# EAGLE design SpectroSlave (EAGLE 7.3.0)
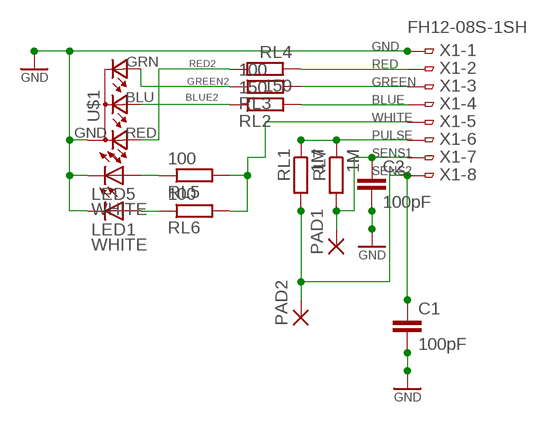
[diagram p0: schematic, sheet 1]

## Parts
C1  100pF  C-EUC0805  [C0805]
C2  100pF  C-EUC0805  [C0805]
LED1  WHITE  LED3MM  [LED3MM]
LED5  WHITE  LED3MM  [LED3MM]
PAD1  SMD5  [SMD2,54-5,08]
PAD2  SMD5  [SMD2,54-5,08]
RL1  1M  R-EU_R0805  [R0805]
RL2  150  R-EU_R0805  [R0805]
RL3  100  R-EU_R0805  [R0805]
RL4  150  R-EU_R0805  [R0805]
RL5  100  R-EU_R0805  [R0805]
RL6  100  R-EU_R0805  [R0805]
RL7  1M  R-EU_R0805  [R0805]
U$1  RGB-COMMON-CATHODE  [LED-TRICOLOR-THROUGHHOLE]
X1  FH12-08S-1SH  [FH12-08S-1SH]

## Nets
BLUE: RL2.2 X1.4
BLUE2: RL2.1 U$1.BLU(CBLUE)
GND [power]: C1.2 C2.2 LED1.K(C) LED5.K(C) U$1.GND(A2) X1.1
GREEN: RL3.2 X1.3
GREEN2: RL3.1 U$1.GRN(CGREEN)
N$4: LED5.A RL5.1
N$5: LED1.A RL6.1
PULSE: RL1.1 RL7.1 X1.6
RED: RL4.1 X1.2
RED2: RL4.2 U$1.RED(CRED)
SENS1: C2.1 PAD1.1(P) RL7.2 X1.7
SENS2: C1.1 PAD2.1(P) RL1.2 X1.8
WHITE: RL5.2 RL6.2 X1.5

## Library data of the parts
C1 C2 = rcl:C-EU: CAPACITOR, European symbol
LED1 LED5 = led:LED: LED OSRAM: - CHIPLED LG R971, LG N971, LY N971, LG Q971, LY Q971, LO R971, LY R971 LH N974, LH R974 LS Q976, LO Q976, LY Q976 LO Q996 - Hyper CHIPLED LW Q18S LB Q993, LB Q99A, LB R99A - SideLED LS A670, LO A670, LY A670, LG A670, LP A670 LB A673, LV A673, LT A673, LW A673 LH A674 LY A675 LS A676, LA A676, LO A676, LY A676, LW A676 LS A679, LY A679, LG A679 - Hyper Micro SIDELED® LS Y876, LA Y876, LO Y876, LY Y876 LT Y87S - SmartLED LW L88C, LW L88S LB L89C, LB L89S, LG L890 LS L89K, LO L89K, LY L89K LS L896, LA L896, LO L896, LY L896 - TOPLED LS T670, LO T670, LY T670, LG T670, LP T670 LSG T670, LSP T670, LSY T670, LOP T670, LYG T670 LG T671, LOG T671, LSG T671 LB T673, LV T673, LT T673, LW T673 LH T674 LS T676, LA T676, LO T676, LY T676, LB T676, LH T676, LSB T676, LW T676 LB T67C, LV T67C, LT T67C, LS T67K, LO T67K, LY T67K, LW E67C LS E67B, LA E67B, LO E67B, LY E67B, LB E67C, LV E67C, LT E67C LW T67C LS T679, LY T679, LG T679 LS T770, LO T770, LY T770, LG T770, LP T770 LB T773, LV T773, LT T773, LW T773 LH T774 LS E675, LA E675, LY E675, LS T675 LS T776, LA T776, LO T776, LY T776, LB T776 LHGB T686 LT T68C, LB T68C - Hyper Mini TOPLED® LB M676 - Mini TOPLED Santana® LG M470 LS M47K, LO M47K, LY M47K Source: http://www.osram.convergy.de LUXEON: - LUMILED® LXK2-PW12-R00, LXK2-PW12-S00, LXK2-PW14-U00, LXK2-PW14-V00 LXK2-PM12-R00, LXK2-PM12-S00, LXK2-PM14-U00 LXK2-PE12-Q00, LXK2-PE12-R00, LXK2-PE12-S00, LXK2-PE14-T00, LXK2-PE14-U00 LXK2-PB12-K00, LXK2-PB12-L00, LXK2-PB12-M00, LXK2-PB14-N00, LXK2-PB14-P00, LXK2-PB14-Q00 LXK2-PR12-L00, LXK2-PR12-M00, LXK2-PR14-Q00, LXK2-PR14-R00 LXK2-PD12-Q00, LXK2-PD12-R00, LXK2-PD12-S00 LXK2-PH12-R00, LXK2-PH12-S00 LXK2-PL12-P00, LXK2-PL12-Q00, LXK2-PL12-R00 Source: www.luxeon.com KINGBRIGHT: KA-3528ASYC Source: www.kingbright.com
PAD1 PAD2 = wirepad:SMD5: SMD PAD
RL1-RL7 = rcl:R-EU_: RESISTOR, European symbol
U$1 = lpatiny:RGB-COMMON-CATHODE
X1 = con-hirose:FH12-08S-1S: 1mm Pitch Connectors For FPC/FFC Source: Data sheet <http://www.hirose.co.jp/cataloge_hp/e58605370.pdf>; OC_FARNELL: unknown; OC_NEWARK: unknown

## Net classes
0 default: width 0.457 mm
1 power: width 0.457 mm
2 VIN: width 0.457 mm
3 fine: width 0.457 mm
4 aref: width 0.457 mm

## Board
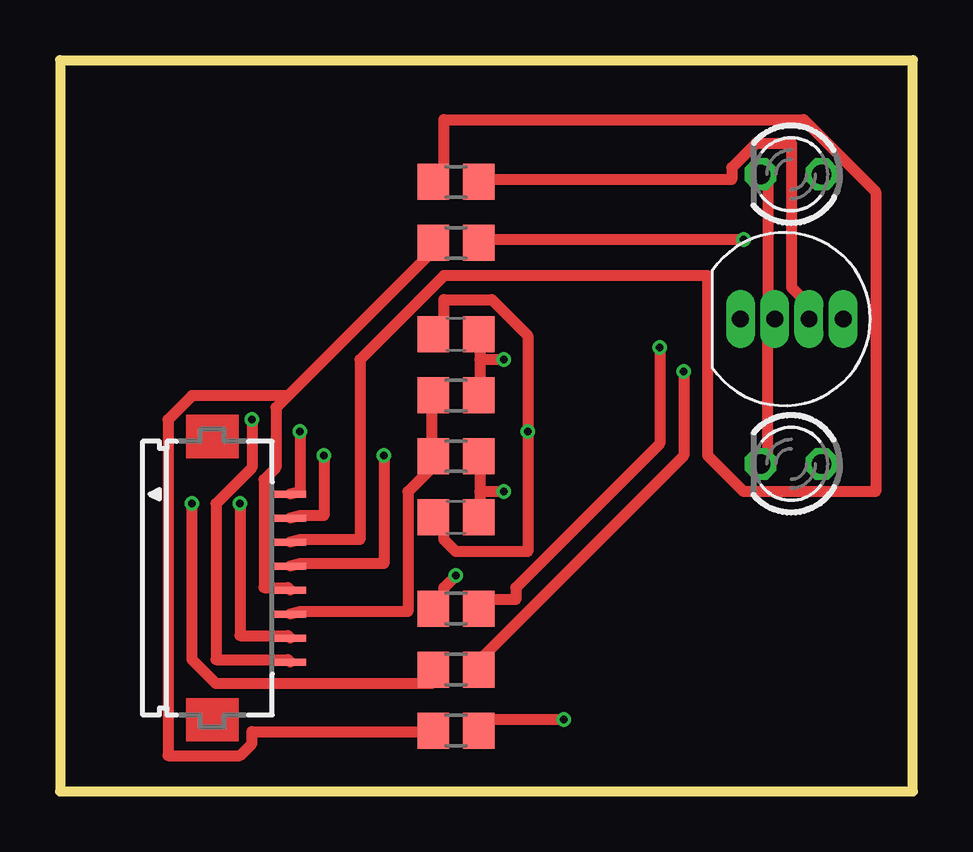
[diagram p1: board, top side]
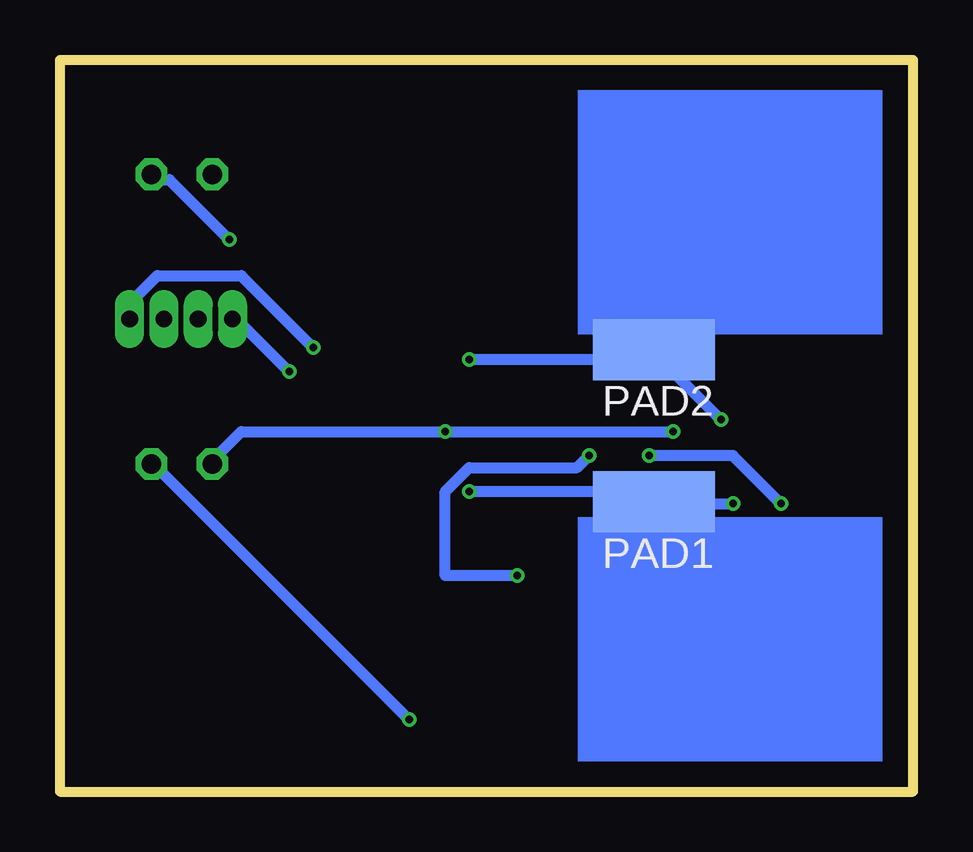
[diagram p2: board, bottom side, seen from below]

Size 35.56 x 30.48 mm. Coordinates in mm from the lower left corner, seen from the top.
Outline: 0,30.48 35.56,30.48 35.56,0 0,0 0,30.48
Copper layers (1*16): Top 0.035mm / dielectric 1.5mm / Bottom 0.035mm
Design rules "Fusion_eagle_rule_v1.1": minimum track width 6mil, minimum drill 12mil, track to track 6mil, track to pad 6mil, pad to pad 6mil, via to via 6mil, smd to smd 0mil, copper to edge 10mil, drill to drill 10mil, minimum pad ring 10mil, minimum via ring 6mil, stop-mask expansion 2mil, vias tented up to drill 100mil, thermal gap 10mil

### Footprints (pad centres in the part's own frame; a part is rotated, then mirrored left to right if it is on the bottom)
C0805 = smd 1.3 x 1.5: 1 -0.95,0; 2 0.95,0
LED3MM = drill 0.813 octagon: A -1.27,0; K 1.27,0
SMD2,54-5,08 = smd 2.54 x 5.08: 1 0,0
R0805 = smd 1.3 x 1.5: 1 -0.95,0; 2 0.95,0
LED-TRICOLOR-THROUGHHOLE = drill 0.7 long: BLU 2.175,0; GND -0.682,0; GRN 0.746,0; RED -2.111,0
FH12-08S-1SH = smd 0.3 x 1.3: 1 -3.5,3.25; 2 -2.5,3.25; 3 -1.5,3.25; 4 -0.5,3.25; 5 0.5,3.25; 6 1.5,3.25; 7 2.5,3.25; 8 3.5,3.25

### Placement (x,y rotation side)
C1  16.51,19.05 180 top
C2  16.51,11.43 180 top
LED1  30.48,13.65 180 top
LED5  30.48,25.72 180 top
PAD1  10.79,12.06 90 bottom
PAD2  10.79,18.41 90 bottom
RL1  16.51,16.51 0 top
RL2  16.51,7.62 180 top
RL3  16.51,25.4 180 top
RL4  16.51,5.08 0 top
RL5  16.51,22.86 180 top
RL6  16.51,2.54 180 top
RL7  16.51,13.97 0 top
U$1  30.48,19.68 0 top
X1  6.35,8.89 270 top

### Tracks (layer width: path | path; a pad name or v marks a point on that pad's centre or on a via)
BLUE  (via drill 0.3)
  Top 0.457: v13.5,14 13.5,9.5 10,9.5 X1.4 | v16.5,9 16,8.5 16,8 RL2.2
  Bottom 0.457: v13.5,14 14,13.5 18.5,13.5 19.5,12.5 19.5,9 v16.5,9
BLUE2  (via drill 0.3)
  Top 0.457: v25,18.5 25,14.5 19,8.5 19,8 17.5,8 RL2.1
  Bottom 0.457: v25,18.5 28,21.5 31.5,21.5 33,20 U$1.BLU
GND  (via drill 0.3)
  Top 0.457: C2.2 16,11 16,10.5 16.5,10 19.5,10 v19.5,15 19.5,19 18,20.5 16,20.5 16,19.5 C1.2 | LED5.K 29.5,25.5 29.5,20 U$1.GND 29.5,19.5 29.5,14 LED1.K | v10,15 10,12.5 X1.1
  Bottom 0.457: v10,15 v19.5,15 28,15 29,14 LED1.K
GREEN
  Top 0.457: X1.3 10,10.5 12.5,10.5 12.5,18 16,21.5 27,21.5 27,14 28.5,12.5 34,12.5 34,25 31,28 16,28 16,25.5 RL3.2
GREEN2
  Top 0.457: RL3.1 17.5,25.5 28,25.5 28,26 29,27 30.5,27 30.5,21 31,20.5 31,20 U$1.GRN
N$4  (via drill 0.3)
  Top 0.457: v28.5,23 17.5,23 RL5.1
  Bottom 0.457: v28.5,23 31,25.5 31.5,25.5 LED5.A
N$5  (via drill 0.3)
  Top 0.457: v21,3 17.5,3 RL6.1
  Bottom 0.457: v21,3 31.5,13.5 LED1.A
PULSE
  Top 0.457: X1.6 10,7.5 14.5,7.5 14.5,12.5 15.5,13.5 RL7.1 15.5,14 15.5,16.5 RL1.1
RED  (via drill 0.3)
  Top 0.457: v11,14 11,11.5 10,11.5 X1.2 | v5.5,12 5.5,5.5 6.5,4.5 15.5,4.5 15.5,5 RL4.1
  Bottom 0.457: v11,14 7.5,14 v5.5,12
RED2  (via drill 0.3)
  Top 0.457: v26,17.5 26,14 17.5,5.5 RL4.2
  Bottom 0.457: v26,17.5 28,19.5 U$1.RED
SENS1  (via drill 0.3)
  Top 0.457: 17.5,12.5 17.5,13.5 RL7.2 | 17.5,12.5 17.5,11.5 C2.1 | v7.5,12 7.5,6.5 9.5,6.5 X1.7 | v18.5,12.5 17.5,12.5
  Bottom 0.457: v7.5,12 10.5,12 PAD1.1 11,12.5 v18.5,12.5
SENS2  (via drill 0.3)
  Top 0.457: 17.5,18 17.5,19 C1.1 | 17.5,18 17.5,17 RL1.2 | v8,15.5 8,13.5 6.5,12 6.5,5.5 9.5,5.5 X1.8 | v18.5,18 17.5,18
  Bottom 0.457: v8,15.5 10.5,18 PAD2.1 11,18 v18.5,18
WHITE
  Top 0.457: 9.5,16.5 15.5,22.5 RL5.2 | 9.5,16.5 9,16 9,13.5 8.5,13 8.5,8.5 9.5,8.5 X1.5 | 9.5,16.5 5.5,16.5 4.5,15.5 4.5,1.5 7.5,1.5 8,2 8,2.5 15.5,2.5 RL6.2
(copper drawn outside any net)
  shapes: Bottom area x2

### Text on the board
203bmp: C:/Users/G/Pictures/logo_epfl.bmp